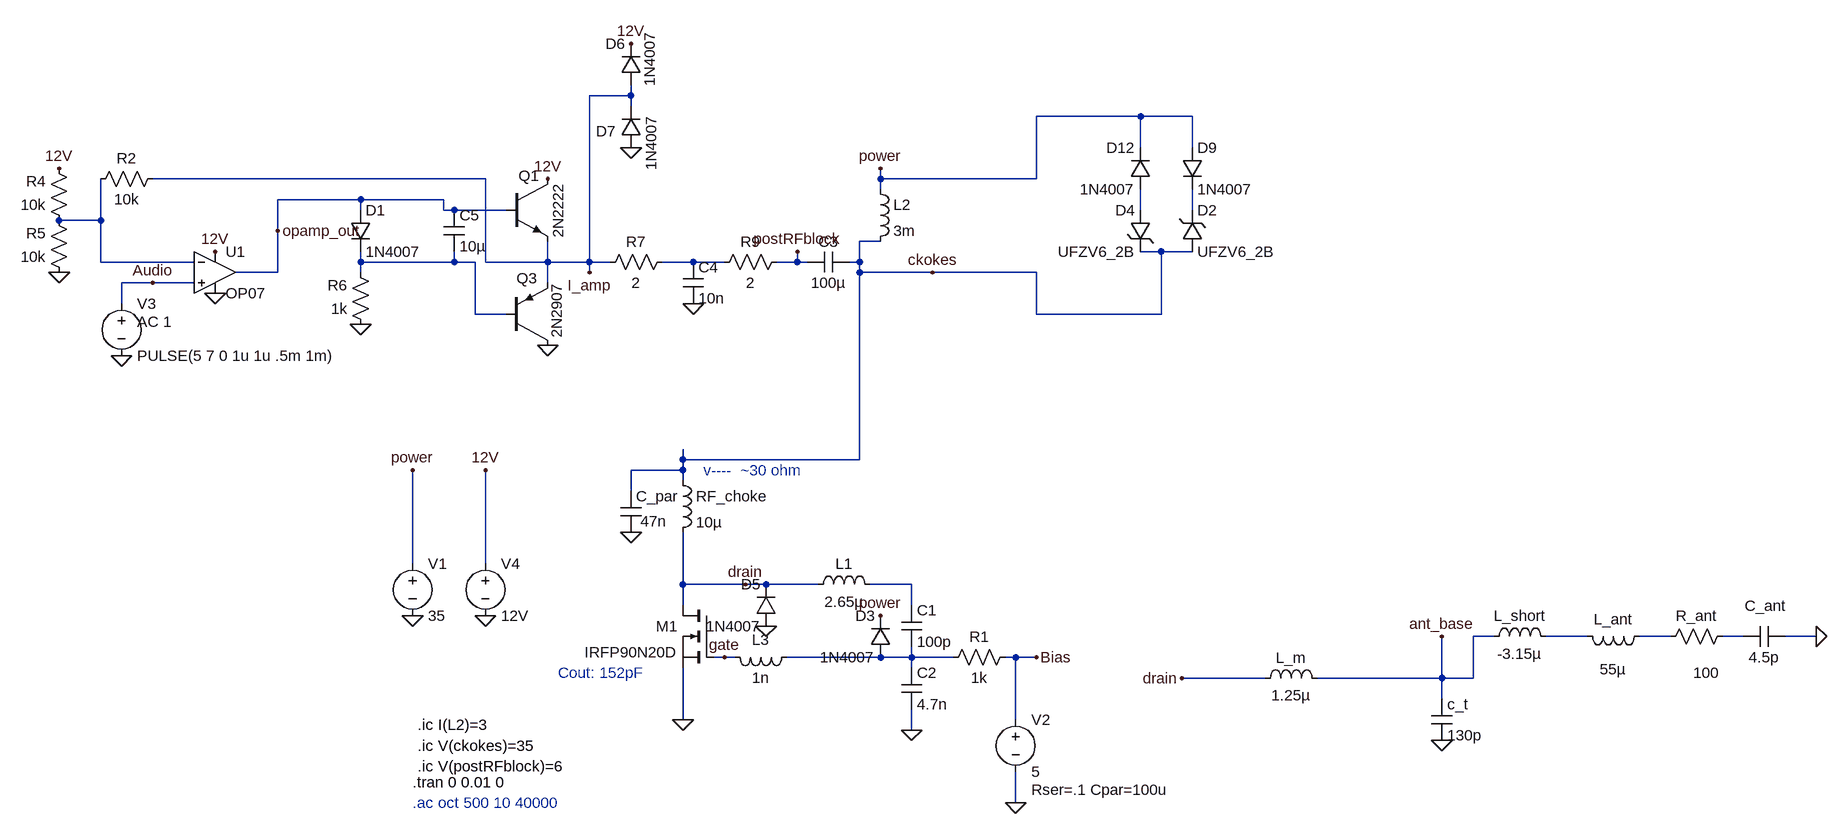
[diagram p0: schematic AMhz10-radio.asc]
AMhz10-radio.asc, the LTspice schematic file:
Version 4
SHEET 1 2004 680
WIRE 160 -736 160 -752
WIRE 160 -736 96 -736
WIRE 160 -720 160 -736
WIRE 944 -704 784 -704
WIRE 1024 -704 944 -704
WIRE 944 -656 944 -704
WIRE 1024 -656 1024 -704
WIRE -64 -608 -576 -608
WIRE 544 -608 544 -624
WIRE 784 -608 784 -704
WIRE 784 -608 544 -608
WIRE 544 -592 544 -608
WIRE -256 -576 -384 -576
WIRE -128 -576 -256 -576
WIRE -256 -560 -256 -576
WIRE -128 -560 -128 -576
WIRE -112 -560 -128 -560
WIRE -32 -560 -112 -560
WIRE 944 -560 944 -592
WIRE 1024 -560 1024 -592
WIRE -656 -544 -656 -608
WIRE -656 -544 -720 -544
WIRE -384 -528 -384 -576
WIRE 544 -512 512 -512
WIRE 976 -496 944 -496
WIRE 1024 -496 976 -496
WIRE -656 -480 -656 -544
WIRE -512 -480 -656 -480
WIRE -256 -480 -256 -496
WIRE -112 -480 -112 -496
WIRE -112 -480 -256 -480
WIRE -80 -480 -112 -480
WIRE -64 -480 -64 -608
WIRE 32 -480 32 -512
WIRE 32 -480 -64 -480
WIRE 96 -480 96 -736
WIRE 96 -480 32 -480
WIRE 128 -480 96 -480
WIRE 256 -480 208 -480
WIRE 304 -480 256 -480
WIRE 416 -480 416 -496
WIRE 416 -480 384 -480
WIRE 432 -480 416 -480
WIRE 512 -480 512 -512
WIRE 512 -480 496 -480
WIRE -384 -464 -384 -528
WIRE -384 -464 -448 -464
WIRE -256 -464 -256 -480
WIRE 96 -464 96 -480
WIRE 512 -464 512 -480
WIRE 624 -464 512 -464
WIRE 784 -464 624 -464
WIRE -576 -448 -624 -448
WIRE -512 -448 -576 -448
WIRE 32 -448 32 -480
WIRE -624 -416 -624 -448
WIRE -80 -400 -80 -480
WIRE -32 -400 -80 -400
WIRE 784 -400 784 -464
WIRE 976 -400 976 -496
WIRE 976 -400 784 -400
WIRE 240 -176 240 -192
WIRE 512 -176 512 -464
WIRE 512 -176 240 -176
WIRE 240 -160 240 -176
WIRE 240 -160 160 -160
WIRE 240 -144 240 -160
WIRE 160 -128 160 -160
WIRE -176 -16 -176 -160
WIRE -64 -16 -64 -160
WIRE 240 16 240 -64
WIRE 336 16 240 16
WIRE 368 16 336 16
WIRE 448 16 368 16
WIRE 592 16 528 16
WIRE 240 48 240 16
WIRE 592 48 592 16
WIRE 1488 96 1456 96
WIRE 1632 96 1568 96
WIRE 1760 96 1712 96
WIRE 1872 96 1840 96
WIRE 1984 96 1936 96
WIRE 304 128 288 128
WIRE 320 128 304 128
WIRE 544 128 400 128
WIRE 592 128 592 112
WIRE 592 128 544 128
WIRE 656 128 592 128
WIRE 752 128 736 128
WIRE 784 128 752 128
WIRE 592 144 592 128
WIRE 1136 160 1008 160
WIRE 1408 160 1408 96
WIRE 1408 160 1216 160
WIRE 1456 160 1456 96
WIRE 1456 160 1408 160
WIRE 1408 192 1408 160
WIRE 240 224 240 144
WIRE 752 224 752 128
WIRE 592 240 592 208
WIRE 752 352 752 304
FLAG 240 224 0
FLAG 592 240 0
FLAG -176 64 0
FLAG 752 352 0
FLAG 784 128 Bias
FLAG 1984 96 0
FLAG 304 128 gate
FLAG 1408 96 ant_base
FLAG 1408 256 0
FLAG 336 16 drain
FLAG 1008 160 drain
FLAG 160 -64 0
FLAG -480 -432 0
FLAG -480 -496 12V
FLAG -256 -384 0
FLAG 32 -352 0
FLAG 32 -608 12V
FLAG -720 -464 0
FLAG -720 -624 12V
FLAG -624 -336 0
FLAG 544 -624 power
FLAG -176 -160 power
FLAG 544 64 power
FLAG 368 80 0
FLAG -576 -448 Audio
FLAG -384 -528 opamp_out
FLAG -64 64 0
FLAG -64 -160 12V
FLAG 160 -816 12V
FLAG 160 -656 0
FLAG 256 -416 0
FLAG 96 -464 I_amp
FLAG 624 -464 ckokes
FLAG 416 -496 postRFblock
SYMBOL nmos 288 48 M0
SYMATTR InstName M1
SYMATTR Value IRFP90N20D
SYMBOL ind 432 32 R270
WINDOW 0 32 56 VTop 2
WINDOW 3 5 56 VBottom 2
SYMATTR InstName L1
SYMATTR Value 2.65µ
SYMATTR SpiceLine Rser=150m
SYMBOL cap 576 48 R0
SYMATTR InstName C1
SYMATTR Value 100p
SYMATTR SpiceLine Rser=1m
SYMBOL voltage -176 -32 R0
WINDOW 123 0 0 Left 0
WINDOW 39 24 124 Left 2
SYMATTR InstName V1
SYMATTR Value 35
SYMBOL voltage 752 208 R0
WINDOW 123 0 0 Left 0
WINDOW 39 24 124 Left 2
SYMATTR SpiceLine Rser=.1 Cpar=100u
SYMATTR InstName V2
SYMATTR Value 5
SYMBOL cap 576 144 R0
SYMATTR InstName C2
SYMATTR Value 4.7n
SYMATTR SpiceLine Rser=1m
SYMBOL res 752 112 R90
WINDOW 0 0 56 VBottom 2
WINDOW 3 32 56 VTop 2
SYMATTR InstName R1
SYMATTR Value 1k
SYMBOL cap 1936 80 R90
WINDOW 0 -16 30 VBottom 2
WINDOW 3 32 32 VTop 2
SYMATTR InstName C_ant
SYMATTR Value 4.5p
SYMBOL res 1744 112 R270
WINDOW 0 32 56 VTop 2
WINDOW 3 -24 71 VBottom 2
SYMATTR InstName R_ant
SYMATTR Value 100
SYMBOL ind 1728 80 R90
WINDOW 0 5 56 VBottom 2
WINDOW 3 51 57 VTop 2
SYMATTR InstName L_ant
SYMATTR Value 55µ
SYMBOL cap 1392 192 R0
SYMATTR InstName c_t
SYMATTR Value 130p
SYMBOL ind 1120 176 R270
WINDOW 0 32 56 VTop 2
WINDOW 3 5 56 VBottom 2
SYMATTR InstName L_m
SYMATTR Value 1.25µ
SYMBOL ind 1472 112 R270
WINDOW 0 32 56 VTop 2
WINDOW 3 5 56 VBottom 2
SYMATTR InstName L_short
SYMATTR Value -3.15µ
SYMBOL ind 224 -160 R0
SYMATTR InstName RF_choke
SYMATTR Value 10µ
SYMATTR SpiceLine Rser=10m
SYMBOL cap 144 -128 R0
WINDOW 3 31 47 Left 2
SYMATTR Value 47n
SYMATTR InstName C_par
SYMBOL res -560 -624 R90
WINDOW 0 0 56 VBottom 2
WINDOW 3 32 56 VTop 2
SYMATTR InstName R2
SYMATTR Value 10k
SYMBOL res -704 -528 R180
WINDOW 0 36 76 Left 2
WINDOW 3 36 40 Left 2
SYMATTR InstName R4
SYMATTR Value 10k
SYMBOL res -704 -448 R180
WINDOW 0 36 76 Left 2
WINDOW 3 36 40 Left 2
SYMATTR InstName R5
SYMATTR Value 10k
SYMBOL diode -272 -560 R0
SYMATTR InstName D1
SYMATTR Value 1N4007
SYMBOL res -240 -368 R180
WINDOW 0 36 76 Left 2
WINDOW 3 36 40 Left 2
SYMATTR InstName R6
SYMATTR Value 1k
SYMBOL npn -32 -608 R0
WINDOW 0 19 -5 Left 2
WINDOW 3 80 6 VRight 2
SYMATTR InstName Q1
SYMATTR Value 2N2222
SYMBOL pnp -32 -352 M180
WINDOW 0 16 103 Left 2
WINDOW 3 78 96 VLeft 2
SYMATTR InstName Q3
SYMATTR Value 2N2907
SYMBOL voltage -624 -432 R0
WINDOW 123 24 44 Left 2
WINDOW 39 24 124 Left 2
SYMATTR Value2 AC 1
SYMATTR InstName V3
SYMATTR Value PULSE(5 7 0 1u 1u .5m 1m)
SYMBOL ind 528 -608 R0
SYMATTR InstName L2
SYMATTR Value 3m
SYMATTR SpiceLine Rser=.5
SYMBOL cap -128 -560 R0
SYMATTR InstName C5
SYMATTR Value 10µ
SYMBOL diode 560 128 R180
WINDOW 0 24 64 Left 2
WINDOW 3 24 0 Left 2
SYMATTR InstName D3
SYMATTR Value 1N4007
SYMBOL diode 384 80 R180
WINDOW 0 24 64 Left 2
WINDOW 3 24 0 Left 2
SYMATTR InstName D5
SYMATTR Value 1N4007
SYMBOL diode 1008 -656 R0
SYMATTR InstName D9
SYMATTR Value 1N4007
SYMBOL diode 960 -592 R180
WINDOW 0 24 64 Left 2
WINDOW 3 24 0 Left 2
SYMATTR InstName D12
SYMATTR Value 1N4007
SYMBOL cap 496 -496 R90
WINDOW 0 0 32 VBottom 2
WINDOW 3 32 32 VTop 2
SYMATTR InstName C3
SYMATTR Value 100µ
SYMATTR SpiceLine Rser=.15
SYMBOL zener 1008 -496 M180
WINDOW 0 24 64 Left 2
WINDOW 3 24 0 Left 2
SYMATTR InstName D2
SYMATTR Value UFZV6_2B
SYMATTR Description Diode
SYMATTR Type diode
SYMBOL zener 960 -560 M0
SYMATTR InstName D4
SYMATTR Value UFZV6_2B
SYMATTR Description Diode
SYMATTR Type diode
SYMBOL OpAmps\\OP07 -480 -528 R0
SYMATTR InstName U1
SYMBOL res 400 -496 R90
WINDOW 0 0 56 VBottom 2
WINDOW 3 32 56 VTop 2
SYMATTR InstName R9
SYMATTR Value 2
SYMBOL voltage -64 -32 R0
WINDOW 123 0 0 Left 0
WINDOW 39 24 124 Left 2
SYMATTR InstName V4
SYMATTR Value 12V
SYMBOL diode 176 -752 R180
WINDOW 0 24 64 Left 2
WINDOW 3 -13 -2 VRight 2
SYMATTR InstName D6
SYMATTR Value 1N4007
SYMBOL diode 176 -656 R180
WINDOW 0 39 25 Left 2
WINDOW 3 -15 -35 VRight 2
SYMATTR InstName D7
SYMATTR Value 1N4007
SYMBOL cap 240 -480 R0
SYMATTR InstName C4
SYMATTR Value 10n
SYMBOL res 224 -496 R90
WINDOW 0 0 56 VBottom 2
WINDOW 3 32 56 VTop 2
SYMATTR InstName R7
SYMATTR Value 2
SYMBOL ind 416 112 R90
WINDOW 0 5 56 VBottom 2
WINDOW 3 32 56 VTop 2
SYMATTR InstName L3
SYMATTR Value 1n
SYMATTR SpiceLine Rser=1m
TEXT -176 320 Left 2 !.tran 0 0.01 0
TEXT 48 152 Left 2 ;Cout: 152pF
TEXT 272 -160 Left 2 ;v----  ~30 ohm
TEXT -176 352 Left 2 ;.ac oct 500 10 40000
TEXT -168 296 Left 2 !.ic V(postRFblock)=6
TEXT -168 264 Left 2 !.ic V(ckokes)=35
TEXT -168 232 Left 2 !.ic I(L2)=3

The netlist it stands for:
* AMhz10-radio.asc
M1 drain gate 0 0 IRFP90N20D
L1 drain N006 2.65µ Rser=150m
C1 N006 N010 100p Rser=1m
V1 power 0 35
V2 Bias 0 5 Rser=.1 Cpar=100u
C2 N010 0 4.7n Rser=1m
R1 Bias N010 1k
C_ant 0 N009 4.5p
R_ant N008 N009 100
L_ant N008 N007 55µ
c_t ant_base 0 130p
L_m drain ant_base 1.25µ
L_short ant_base N007 -3.15µ
L§RF_choke ckokes drain 10µ Rser=10m
C_par ckokes 0 47n
R2 I_amp N003 10k
R4 N003 12V 10k
R5 0 N003 10k
D1 opamp_out N004 1N4007
R6 0 N004 1k
Q1 12V opamp_out I_amp 0 2N2222
Q3 0 N004 I_amp 0 2N2907
V3 Audio 0 PULSE(5 7 0 1u 1u .5m 1m) AC 1
L2 power ckokes 3m Rser=.5
C5 opamp_out N004 10µ
D3 N010 power 1N4007
D5 0 drain 1N4007
D9 power N002 1N4007
D12 N001 power 1N4007
C3 ckokes postRFblock 100µ Rser=.15
D2 ckokes N002 UFZV6_2B
D4 N001 ckokes UFZV6_2B
XU1 Audio N003 12V 0 opamp_out LT1001  ; OP07, pins In+ In- V+ V- OUT
R9 postRFblock N005 2
V4 12V 0 12V
D6 I_amp 12V 1N4007
D7 0 I_amp 1N4007
C4 N005 0 10n
R7 N005 I_amp 2
L3 N010 gate 1n Rser=1m
.model D D
.lib standard.dio
.model NPN NPN
.model PNP PNP
.lib standard.bjt
.model NMOS NMOS
.model PMOS PMOS
.lib standard.mos
.tran 0 0.01 0
* Cout: 152pF
* v----  ~30 ohm
* .ac oct 500 10 40000
.ic V(postRFblock)=6
.ic V(ckokes)=35
.ic I(L2)=3
.lib LTC.lib
.backanno
.end